# Altium project BK5811.PrjPcb
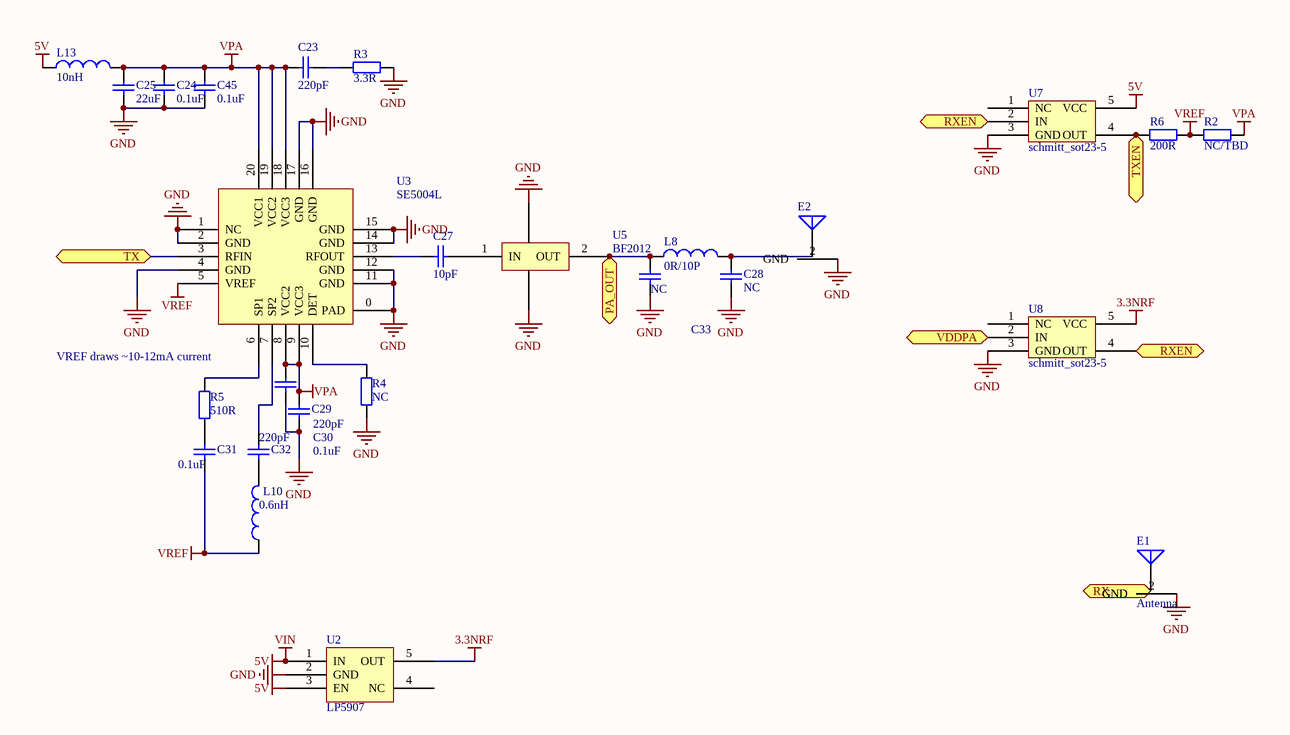
[diagram p0: PA.SchDoc]
2 sheets, 60 parts. Net scope: flat (ports and power ports of the same name join across sheets).
Board file: 5811-PA.PcbDoc
Sheets:
  PA.SchDoc
  BK5811.SchDoc

## Sheet PA.SchDoc
size A4

### Parts
C23  value 220pF  [0402]  (hidden comment: Cap)
C24  value 0.1uF  [0402]  (hidden comment: Cap)
C25  value 22uF  [0805]  (hidden comment: Cap)
C27  value 10pF  [0402]  (hidden comment: Cap)
C28  value NC  [0402]  (hidden comment: Cap)
C29  value 0.1uF  [0402]  (hidden comment: Cap)
C30  value 220pF  [0402]  (hidden comment: Cap)
C31  value 0.1uF  [0402]  (hidden comment: Cap)
C32  value 220pF  [0402]  (hidden comment: Cap)
C33  value NC  [0402]  (hidden comment: Cap)
C45  value 0.1uF  [0402]  (hidden comment: Cap)
E1  Antenna  [IPEX]
E2  Antenna  [IPEX]  (value not drawn)
L8  value 0R/10P  [0402]  (hidden comment: Inductor)
L10  value 0.6nH  [0402]  (hidden comment: Inductor)
L13  value 10nH  [0402]  (hidden comment: Inductor)
R2  value NC/TBD  [0402]  (hidden comment: Res2)
R3  value 3.3R  [0402]  (hidden comment: Res2)
R4  value NC  [0402]  (hidden comment: Res2)
R5  value 510R  [0402]  (hidden comment: Res2)
R6  value 200R  [0402]  (hidden comment: Res2)
U2  LP5907  [SOT23-5]
U3  SE5004L  [SE5004L]
U5  BF2012  [LFB2H5]
U7  schmitt_sot23-5  [SOT23-5]
U8  schmitt_sot23-5  [SOT23-5]

### Ports
PA_OUT, RX, RXEN, TX, TXEN, VDDPA

### Nets
3.3NRF: U2.5(OUT) U8.5(VCC)
5V: L13.1 U2.1(IN) U2.3(EN) U7.5(VCC)  [also labelled VIN]
GND: C24.2 C25.1 C28.2 C29.1 C30.1 C33.2 C45.2 E1.2(GND) E2.2(GND) R3.1 R4.1 U2.2(GND) U3.0(PAD) U3.1(NC) U3.2(GND) U3.4(GND) U3.11(GND) U3.12(GND) U3.14(GND) U3.15(GND) U3.16(GND) U3.17(GND) U5.0(GND) U7.3(GND) U8.3(GND)
VPA: C23.2 C24.1 C25.2 C29.2 C30.2 C45.1 L13.2 R2.1 U3.8(VCC2) U3.9(VCC3) U3.18(VCC3) U3.19(VCC2) U3.20(VCC1)
VREF: C31.1 L10.1 R2.2 R6.1 U3.5(VREF)
NetC7_2: E1.1(ANT) ; port RX
NetC13_2: U3.3(RFIN) ; port TX
NetC18_1: U8.2(IN) ; port VDDPA
NetC23_1: C23.1 R3.2
NetC27_1: C27.1 U3.13(RFOUT)
NetC27_2: C27.2 U5.1(IN)
NetC28_1: C28.1 E2.1(ANT) L8.2
NetC31_2: C31.2 R5.1
NetC32_1: C32.1 L10.2
NetC32_2: C32.2 U3.7(SP2)
NetC33_1: C33.1 L8.1 U5.2(OUT) ; port PA_OUT
NetR4_2: R4.2 U3.10(DET)
NetR5_2: R5.2 U3.6(SP1)
NetR6_2: R6.2 U7.4(OUT) ; port TXEN
NetU7_2: U7.2(IN) U8.4(OUT) ; port RXEN

Not connected (* = marked no-connect by the designer): U2 4(NC); U7 1(NC); U8 1(NC)

### Notes on the sheet
- VREF draws ~10-12mA current

### Library data of the parts
C23-C25 C27-C33 C45 = Cap: Capacitor; Published: 8-Jun-2000; LatestRevisionDate: 17-Jul-2002; LatestRevisionNote: Re-released for DXP Platform.; PackageReference: RAD-0.3; Publisher: Altium Limited; PackageDescription: Radial Cap, Thru-Hole; 2 Leads; 0.3 in Pin Spacing
E1 E2 = Antenna: Generic Antenna; Published: 24-Mar-1999; LatestRevisionDate: 17-Jul-2002; LatestRevisionNote: Re-released for DXP Platform.; PackageReference: PIN1; Publisher: Altium Limited
L8 L10 L13 = Inductor: Code_IEC: 1005; Published: 8-Jun-2000; LatestRevisionDate: 29-May-2009; LatestRevisionNote: IPC-7351 Footprint Added.; PackageReference: 0402-A; Publisher: Altium Limited; PackageDescription: Chip Inductor; Code_JEITA: 0402
R2-R6 = Res2: Resistor; Published: 8-Jun-2000; LatestRevisionDate: 17-Jul-2002; LatestRevisionNote: Re-released for DXP Platform.; PackageReference: AXIAL-0.4; Publisher: Altium Limited; PackageDescription: Axial Device, Thru-Hole; 2 Leads; 0.4 in Pin Spacing

## Sheet BK5811.SchDoc
size A4
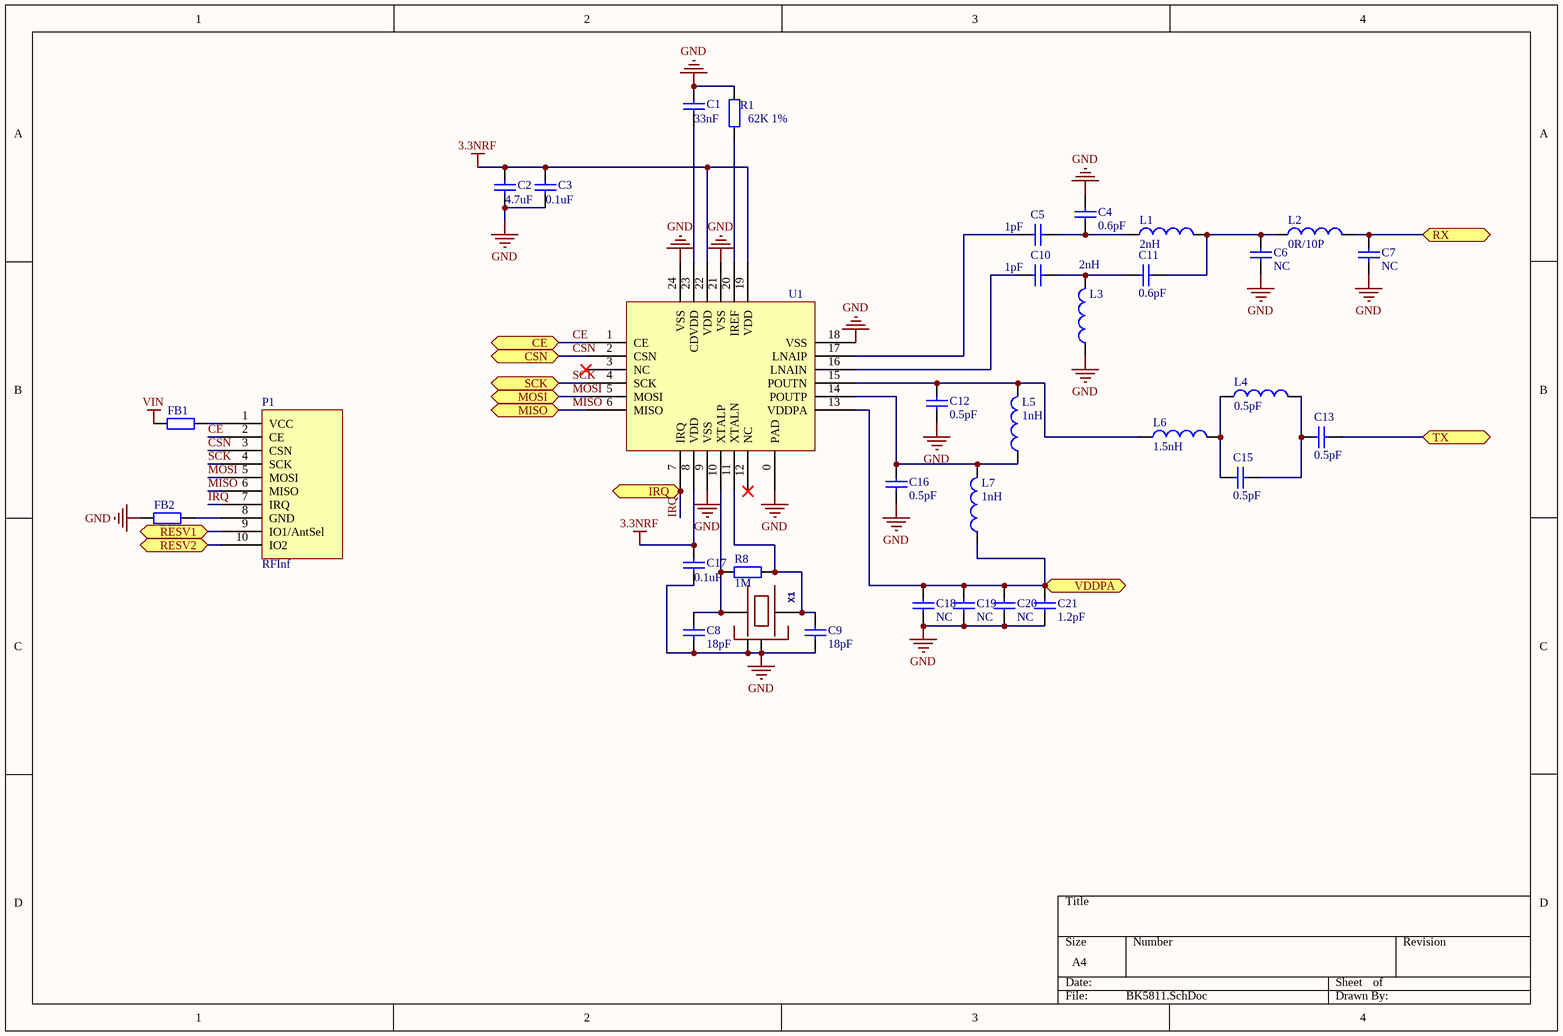
[diagram p1: BK5811.SchDoc]

### Parts
C1  33nF  [0402]
C2  4.7uF  [0603]
C3  0.1uF  [0402]
C4  0.6pF  [0402]
C5  1pF  [0402]
C6  NC  [0402]
C7  NC  [0402]
C8  value 18pF  [0402]  (hidden comment: Cap)
C9  value 18pF  [0402]  (hidden comment: Cap)
C10  1pF  [0402]
C11  0.6pF  [0402]
C12  0.5pF  [0402]
C13  0.5pF  [0402]
C15  0.5pF  [0402]
C16  0.5pF  [0402]
C17  0.1uF  [0402]
C18  NC  [0402]
C19  NC  [0402]
C20  NC  [0402]
C21  1.2pF  [0402]
FB1  Res2  [0402]  (value not drawn)
FB2  Res2  [0402]  (value not drawn)
L1  2nH  [0402]
L2  0R/10P  [0402]
L3  2nH  [0402]
L4  0.5pF  [0402]
L5  1nH  [0402]
L6  1.5nH  [0402]
L7  1nH  [0402]
P1  RFInf  [RFInf - SINGLESIDE]
R1  62K 1%  [0402]
R8  value 1M  [0402]  (hidden comment: Res2)
U1  BK5811  [BK5811]  (value not drawn)
X1  16Mhz  [OSCILLATOR-3.2X2.5]  (value not drawn)

### Ports
CE, CSN, IRQ, MISO, MOSI, RESV1, RESV2, RX, SCK, TX, VDDPA

### Nets
3.3NRF: C2.2 C3.2 C17.2 U1.8(VDD) U1.19(VDD) U1.22(VDD)
GND: C1.2 C2.1 C3.1 C4.2 C6.1 C7.1 C8.2 C9.2 C12.1 C16.1 C17.1 C18.2 C19.2 C20.2 C21.2 FB2.1 L3.1 R1.2 U1.0(PAD) U1.9(VSS) U1.18(VSS) U1.21(VSS) U1.24(VSS) X1.2(NC_2) X1.4(NC_4)
VIN: FB1.1  [project net 5V]
CE: P1.2(CE) U1.1(CE) ; port CE
CSN: P1.3(CSN) U1.2(CSN) ; port CSN
IRQ: P1.7(IRQ) U1.7(IRQ) ; port IRQ
MISO: P1.6(MISO) U1.6(MISO) ; port MISO
MOSI: P1.5(MOSI) U1.5(MOSI) ; port MOSI
SCK: P1.4(SCK) U1.4(SCK) ; port SCK
NetC1_1: C1.1 U1.23(CDVDD)
NetC4_1: C4.1 C5.2 L1.1
NetC5_1: C5.1 U1.17(LNAIP)
NetC6_2: C6.2 C11.1 L1.2 L2.1
NetC7_2: C7.2 L2.2 ; port RX
NetC8_1: C8.1 R8.2 U1.10(XTALP) X1.1
NetC9_1: C9.1 R8.1 U1.11(XTALN) X1.3
NetC10_1: C10.1 U1.16(LNAIN)
NetC10_2: C10.2 C11.2 L3.2
NetC12_2: C12.2 L5.2 L6.1 U1.15(POUTN)
NetC13_1: C13.1 C15.2 L4.2
NetC13_2: C13.2 ; port TX
NetC15_1: C15.1 L4.1 L6.2
NetC16_2: C16.2 L5.1 L7.2 U1.14(POUTP)
NetC18_1: C18.1 C19.1 C20.1 C21.1 L7.1 U1.13(VDDPA) ; port VDDPA
NetFB1_2: FB1.2 P1.1(VCC)
NetFB2_2: FB2.2 P1.8(GND)
NetP1_9: P1.9(IO1/AntSel) ; port RESV1
NetP1_10: P1.10(IO2) ; port RESV2
NetR1_1: R1.1 U1.20(IREF)

Not connected (* = marked no-connect by the designer): U1 3(NC)* 12(NC)*

### Library data of the parts
C1-C13 C15-C21 = Cap: Capacitor; Published: 8-Jun-2000; LatestRevisionDate: 17-Jul-2002; LatestRevisionNote: Re-released for DXP Platform.; PackageReference: RAD-0.3; Publisher: Altium Limited; PackageDescription: Radial Cap, Thru-Hole; 2 Leads; 0.3 in Pin Spacing
FB1 FB2 = Res2: Resistor; Value: FB; Published: 8-Jun-2000; LatestRevisionDate: 17-Jul-2002; LatestRevisionNote: Re-released for DXP Platform.; PackageReference: AXIAL-0.4; Publisher: Altium Limited; PackageDescription: Axial Device, Thru-Hole; 2 Leads; 0.4 in Pin Spacing
L1-L7 = Inductor: Code_IEC: 1005; Published: 8-Jun-2000; LatestRevisionDate: 29-May-2009; LatestRevisionNote: IPC-7351 Footprint Added.; PackageReference: 0402-A; Publisher: Altium Limited; PackageDescription: Chip Inductor; Code_JEITA: 0402
R1 R8 = Res2: Resistor; Published: 8-Jun-2000; LatestRevisionDate: 17-Jul-2002; LatestRevisionNote: Re-released for DXP Platform.; PackageReference: AXIAL-0.4; Publisher: Altium Limited; PackageDescription: Axial Device, Thru-Hole; 2 Leads; 0.4 in Pin Spacing
X1 = OSCILLATOR-3.2X2.5: Crystal Oscillator in 3.2x2.5 SMD

## Nets that join several sheets
3.3NRF: PA (U2.5 U8.5), BK5811 (6 pins)
5V: PA (L13.1 U2.1 U2.3 U7.5), BK5811 (FB1.1)
GND: PA (25 pins), BK5811 (25 pins)
NetC7_2: PA (E1.1), BK5811 (C7.2 L2.2)
NetC13_2: PA (U3.3), BK5811 (C13.2)
NetC18_1: PA (U8.2), BK5811 (6 pins)